# Altium project 2221_LocalisationSousMarine.PrjPcb
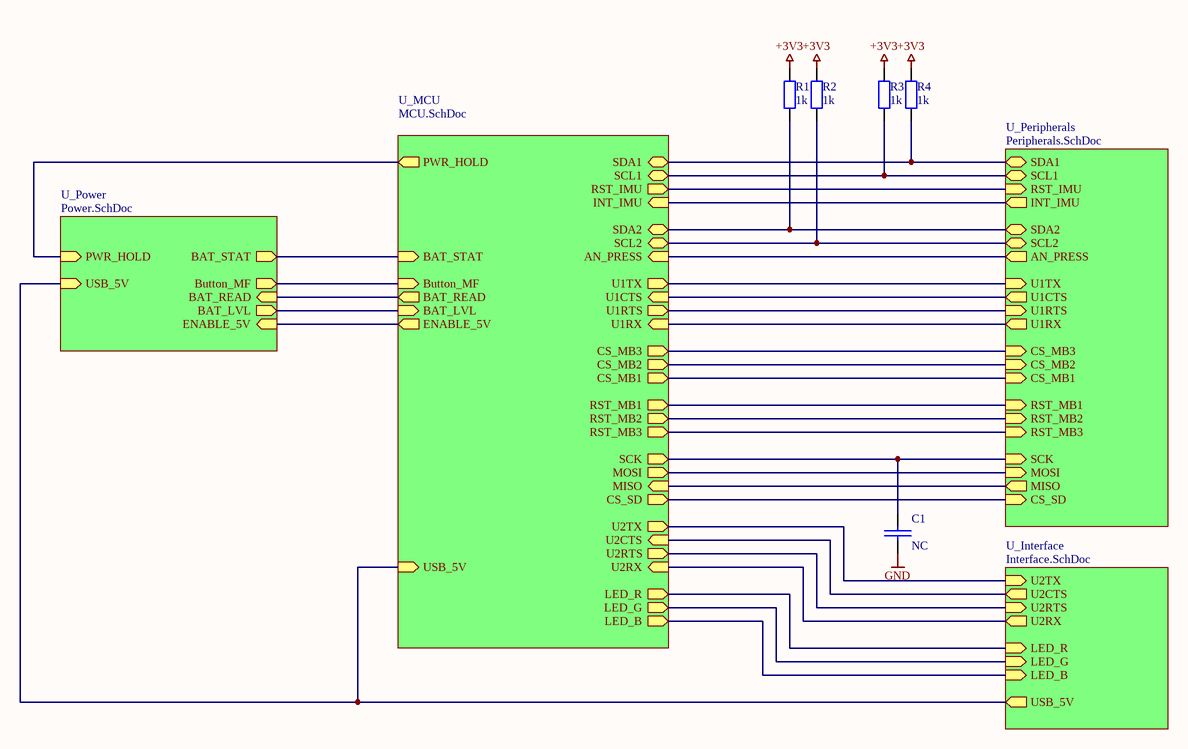
[diagram p0: SchemaBloc.SchDoc]
5 sheets, 150 parts. Net scope: hierarchical (ports join the sheet entries above them; power ports are global).
Board file: ES_Class6C_2L.PcbDoc
Sheets:
  SchemaBloc.SchDoc
    U_MCU = MCU.SchDoc
    U_Interface = Interface.SchDoc
    U_Power = Power.SchDoc
    U_Peripherals = Peripherals.SchDoc

## Sheet SchemaBloc.SchDoc
size A3; Date: 26.01.2022; Author: Ali Zoubir; CompanyName: ETML-ES; DrawnBy: Ali Zoubir; Engineer: Ali Zoubir; Organization: ETML-ES; Address1: Avenue Recordon 1; Address2: 1004 Lausanne; Address3: Switzerland; Revision: 2221; SheetNumber: 1; SheetTotal: 6; Version: V0

### Parts
C1  NC  [6-0805_L]
R1  1k  [6-0805_L]
R2  1k  [6-0805_L]
R3  1k  [6-0805_L]
R4  1k  [6-0805_L]

### Sub-sheets
U_Interface = Interface.SchDoc: USB_5V (out), LED_R (in), LED_G (in), LED_B (in), U2TX (in), U2CTS (out), U2RTS (in), U2RX (out)
U_MCU = MCU.SchDoc: SDA1 (bidir), SCL1 (bidir), CS_SD (out), BAT_STAT (in), RST_IMU (out), INT_IMU (in), PWR_HOLD (out), SDA2 (bidir), SCL2 (bidir), CS_MB1 (out), CS_MB2 (out), U1TX (out), U1CTS (in), U1RTS (out), U1RX (in), MISO (in), MOSI (out), SCK (out), Button_MF (in), CS_MB3 (out), BAT_LVL (in), BAT_READ (out), RST_MB1 (out), RST_MB2 (out), RST_MB3 (out), ENABLE_5V (out), USB_5V (in), LED_R (out), LED_G (out), LED_B (out), U2TX (out), U2CTS (in), U2RTS (out), U2RX (in), AN_PRESS (in)
U_Peripherals = Peripherals.SchDoc: SDA1 (bidir), SCL1 (bidir), RST_IMU (in), INT_IMU (out), CS_MB1 (in), CS_MB2 (in), U1TX (in), U1CTS (out), U1RTS (in), U1RX (out), CS_MB3 (in), SCL2 (bidir), SDA2 (bidir), SCK (in), MOSI (in), MISO (out), RST_MB1 (in), RST_MB2 (in), RST_MB3 (in), CS_SD (in), AN_PRESS (out)
U_Power = Power.SchDoc: BAT_STAT (out), PWR_HOLD (in), Button_MF (out), USB_5V (in), BAT_READ (in), BAT_LVL (out), ENABLE_5V (in)

### Nets
+3V3: R1.2 R2.2 R3.2 R4.2
GND: C1.2
VBUS: sheet U_MCU/USB_5V, sheet U_Interface/USB_5V, sheet U_Power/USB_5V
AnPress: sheet U_MCU/AN_PRESS, sheet U_Peripherals/AN_PRESS
BatLvl: sheet U_MCU/BAT_LVL, sheet U_Power/BAT_LVL
BatRead: sheet U_MCU/BAT_READ, sheet U_Power/BAT_READ
BatStat: sheet U_MCU/BAT_STAT, sheet U_Power/BAT_STAT
ButtonMF: sheet U_MCU/Button_MF, sheet U_Power/Button_MF
CS_SD: sheet U_MCU/CS_SD, sheet U_Peripherals/CS_SD
CSM1: sheet U_MCU/CS_MB1, sheet U_Peripherals/CS_MB1
CSM2: sheet U_MCU/CS_MB2, sheet U_Peripherals/CS_MB2
CSM3: sheet U_MCU/CS_MB3, sheet U_Peripherals/CS_MB3
EN_5V: sheet U_MCU/ENABLE_5V, sheet U_Power/ENABLE_5V
INT_IMU: sheet U_MCU/INT_IMU, sheet U_Peripherals/INT_IMU
LED_B: sheet U_MCU/LED_B, sheet U_Interface/LED_B
LED_G: sheet U_MCU/LED_G, sheet U_Interface/LED_G
LED_R: sheet U_MCU/LED_R, sheet U_Interface/LED_R
MISO: sheet U_MCU/MISO, sheet U_Peripherals/MISO
MOSI: sheet U_MCU/MOSI, sheet U_Peripherals/MOSI
PwrHold: sheet U_MCU/PWR_HOLD, sheet U_Power/PWR_HOLD
RA8: sheet U_MCU/U1CTS, sheet U_Peripherals/U1CTS
RB2: R2.1 ; sheet U_MCU/SCL2, sheet U_Peripherals/SCL2
RB3: R1.1 ; sheet U_MCU/SDA2, sheet U_Peripherals/SDA2
RB4: sheet U_MCU/U1TX, sheet U_Peripherals/U1TX
RB6: sheet U_MCU/RST_IMU, sheet U_Peripherals/RST_IMU
RB8: R3.1 ; sheet U_MCU/SCL1, sheet U_Peripherals/SCL1
RB9: R4.1 ; sheet U_MCU/SDA1, sheet U_Peripherals/SDA1
RB13: sheet U_MCU/U2CTS, sheet U_Interface/U2CTS
RB14: C1.1 ; sheet U_MCU/SCK, sheet U_Peripherals/SCK
RB15: sheet U_MCU/U2RTS, sheet U_Interface/U2RTS
RC2: sheet U_MCU/U2TX, sheet U_Interface/U2TX
RC3: sheet U_MCU/U1RX, sheet U_Peripherals/U1RX
RC4: sheet U_MCU/U1RTS, sheet U_Peripherals/U1RTS
RC8: sheet U_MCU/U2RX, sheet U_Interface/U2RX
RSTM1: sheet U_MCU/RST_MB1, sheet U_Peripherals/RST_MB1
RSTM2: sheet U_MCU/RST_MB2, sheet U_Peripherals/RST_MB2
RSTM3: sheet U_MCU/RST_MB3, sheet U_Peripherals/RST_MB3

### Notes on the sheet
- Fichier :
- a
- Date :
- Heure :
- Version :
- Auteur :
- Modif.
- b
- c
- d
- Projet :
- No :
- Nb feuilles
- Feuille n°
- Chemin :

### Library data of the parts
C1 = C: SDTSourceLibName: C:\WINDOWS\TEMP\DA.LIB; PCB Footprint: RC0805
R1-R4 = Res2: Res 0805; Published: 8-Jun-2000; LatestRevisionDate: 17-Jul-2002; LatestRevisionNote: Re-released for DXP Platform.; PackageReference: AXIAL-0.4; Publisher: Altium Limited; PackageDescription: Axial Device, Thru-Hole; 2 Leads; 0.4 in Pin Spacing; Value: 1k

## Sheet MCU.SchDoc
size A3; Author: Ali Zoubir; Organization: ETML-ES; Address1: Avenue Recordon 1; Address2: 1004 Lausanne; Address3: Switzerland; Revision: 2221; SheetNumber: 2; SheetTotal: 6; SPICEModelCacheGNAZWADN: <root> / <DocumentId>GNAZWADN</DocumentId> / </root>; Version: V0
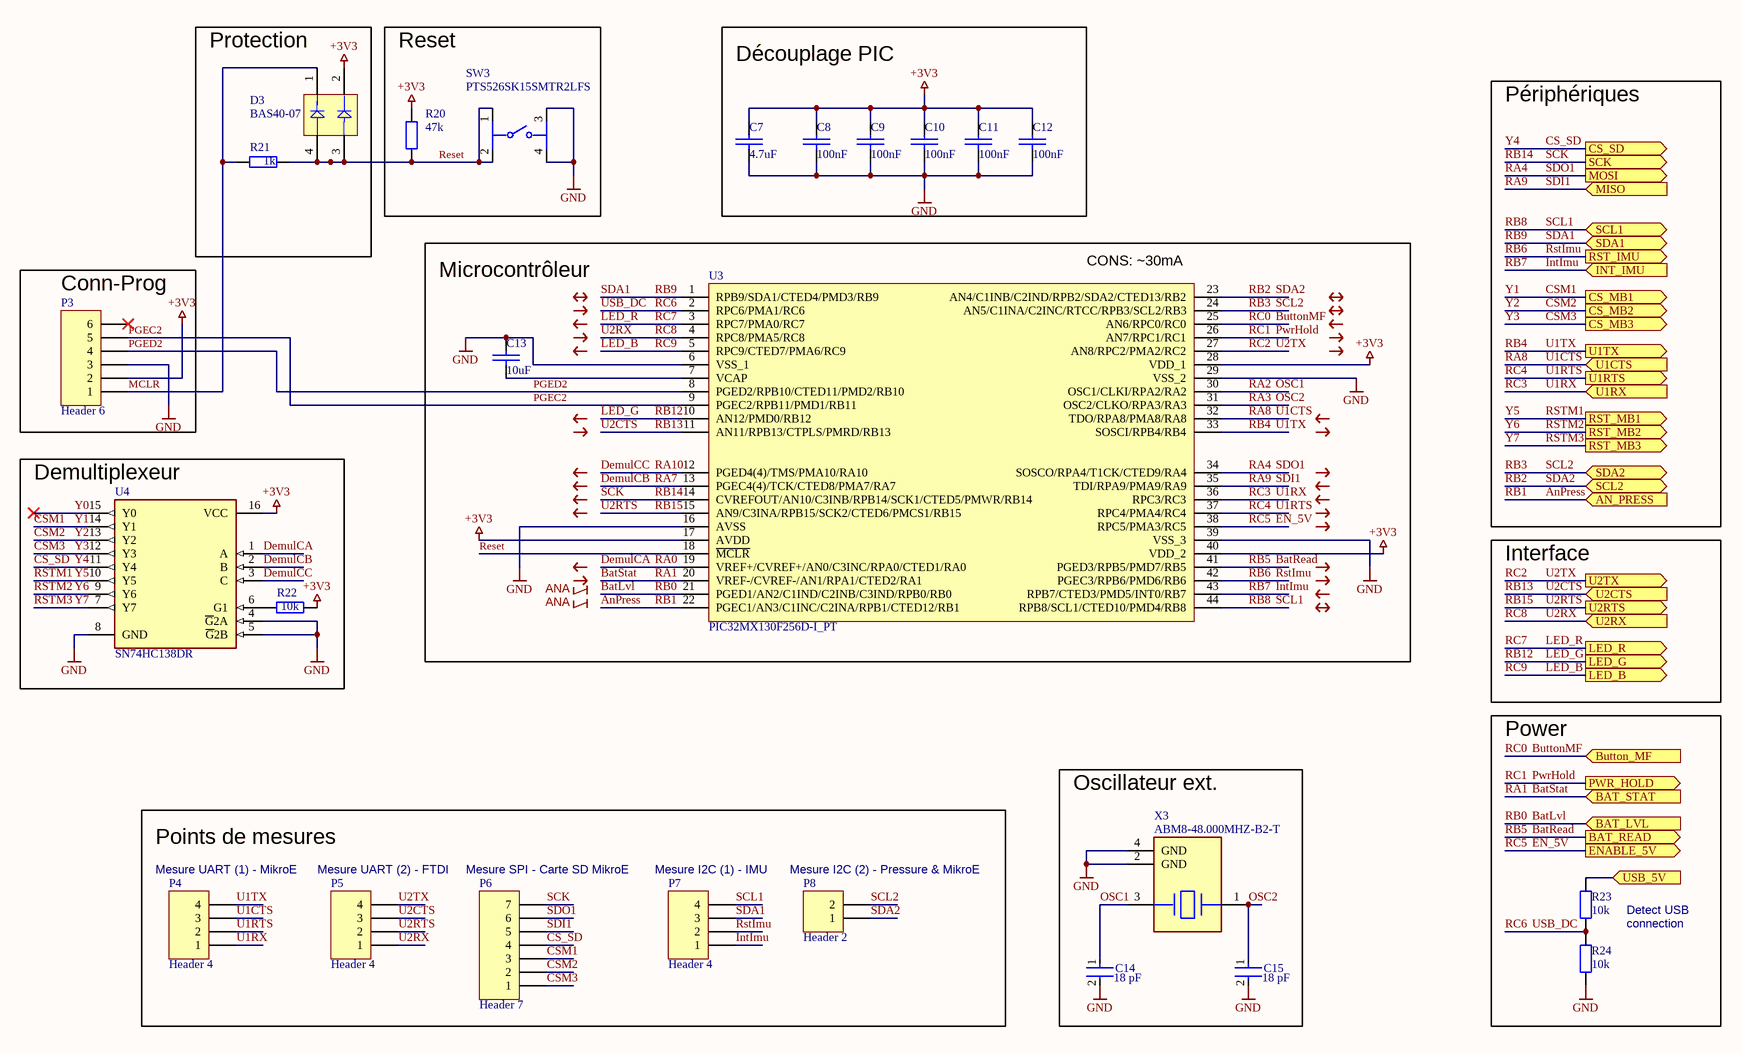
[diagram p1: MCU.SchDoc]

### Parts
C7  4.7uF  [6-0805_L]
C8  100nF  [6-0805_L]
C9  100nF  [6-0805_L]
C10  100nF  [6-0805_L]
C11  100nF  [6-0805_L]
C12  100nF  [6-0805_L]
C13  10uF  [6-0805_L]
C14  Capacitance: 18 pF  [FP-C0805C-DN-MFG]  (hidden comment: C0805C180J5GACTU)
C15  Capacitance: 18 pF  [FP-C0805C-DN-MFG]  (hidden comment: C0805C180J5GACTU)
D3  BAS40-07  [INF-SOT143_V]
P3  Header 6  [HDR1X6]
P4  Header 4  [HDR1X4]
P5  Header 4  [HDR1X4]
P6  Header 7  [HDR1X7]
P7  Header 4  [HDR1X4]
P8  Header 2  [HDR1X2]
R20  47k  [6-0805_L]
R21  1k  [6-0805_L]
R22  10k  [6-0805_L]
R23  10k  [6-0805_L]
R24  10k  [6-0805_L]
SW3  PTS526SK15SMTR2LFS  [FP-PTS526SK15SMTR2LFS-MFG]
U3  PIC32MX130F256D-I_PT  [QFP80P1200X1200X120-44N]
U4  SN74HC138DR  [FP-D0016A-IPC_A]
X3  ABM8-48.000MHZ-B2-T  [FP-ABM8-MFG]

### Blocks framed on the sheet
Protection: D3 R21
Reset: R20 SW3
Découplage PIC: C7-C12
Microcontrôleur: C13 U3
Conn-Prog: P3
Demultiplexeur: R22 U4
Power: R23 R24
Oscillateur ext.: C14 C15 X3
Points de mesures: P4-P8

### Ports
AN_PRESS (in), BAT_LVL (in), BAT_READ (out), BAT_STAT (in), Button_MF (in), CS_MB1 (out), CS_MB2 (out), CS_MB3 (out), CS_SD (out), ENABLE_5V (out), INT_IMU (in), LED_B (out), LED_G (out), LED_R (out), MISO (in), MOSI (out), PWR_HOLD (out), RST_IMU (out), RST_MB1 (out), RST_MB2 (out), RST_MB3 (out), SCK (out), SCL1 (bidir), SCL2 (bidir), SDA1 (bidir), SDA2 (bidir), U1CTS (in), U1RTS (out), U1RX (in), U1TX (out), U2CTS (in), U2RTS (out), U2RX (in), U2TX (out), USB_5V (in)

### Nets
+3V3: C7.1 C8.1 C9.1 C10.1 C11.1 C12.1 D3.2(K2) P3.2 R20.1 R22.2 U3.17(AVDD) U3.28(VDD_1) U3.40(VDD_2) U4.16(VCC)
GND: C7.2 C8.2 C9.2 C10.2 C11.2 C12.2 C13.1 C14.2 C15.2 P3.3 R24.1 SW3.3 SW3.4 U3.6(VSS_1) U3.16(AVSS) U3.29(VSS_2) U3.39(VSS_3) U4.4(~{G}2A) U4.5(~{G}2B) U4.8(GND) X3.2(GND) X3.4(GND)
VBUS: R23.2 ; port USB_5V
AnPress: U3.22(PGEC1/AN3/C1INC/C2INA/RPB1/CTED12/RB1) ; port AN_PRESS  [also labelled RB1]
BatLvl: U3.21(PGED1/AN2/C1IND/C2INB/C3IND/RPB0/RB0) ; port BAT_LVL  [also labelled RB0]
BatRead: U3.41(PGED3/RPB5/PMD7/RB5) ; port BAT_READ  [also labelled RB5]
BatStat: U3.20(VREF-/CVREF-/AN1/RPA1/CTED2/RA1) ; port BAT_STAT  [also labelled RA1]
ButtonMF: U3.25(AN6/RPC0/RC0) ; port Button_MF  [also labelled RC0]
CS_SD: P6.4 U4.11(Y4) ; port CS_SD  [also labelled Y4]
CSM1: P6.3 U4.14(Y1) ; port CS_MB1  [also labelled Y1]
CSM2: P6.2 U4.13(Y2) ; port CS_MB2  [also labelled Y2]
CSM3: P6.1 U4.12(Y3) ; port CS_MB3  [also labelled Y3]
DemulCA: U3.19(VREF+/CVREF+/AN0/C3INC/RPA0/CTED1/RA0) U4.1(A)  [also labelled RA0]
DemulCB: U3.13(PGEC4(4)/TCK/CTED8/PMA7/RA7) U4.2(B)  [also labelled RA7]
DemulCC: U3.12(PGED4(4)/TMS/PMA10/RA10) U4.3(C)  [also labelled RA10]
EN_5V: U3.38(RPC5/PMA3/RC5) ; port ENABLE_5V  [also labelled RC5]
IntImu: P7.1 U3.43(RPB7/CTED3/PMD5/INT0/RB7) ; port INT_IMU  [also labelled RB7]  [project net INT_IMU]
LED_B: U3.5(RPC9/CTED7/PMA6/RC9) ; port LED_B  [also labelled RC9]
LED_G: U3.10(AN12/PMD0/RB12) ; port LED_G  [also labelled RB12]
LED_R: U3.3(RPC7/PMA0/RC7) ; port LED_R  [also labelled RC7]
MCLR: D3.1(K1) P3.1 R21.1
OSC1: C14.1 U3.30(OSC1/CLKI/RPA2/RA2) X3.3  [also labelled RA2]
OSC2: C15.1 U3.31(OSC2/CLKO/RPA3/RA3) X3.1  [also labelled RA3]
PGEC2: P3.5 U3.9(PGEC2/RPB11/PMD1/RB11)
PGED2: P3.4 U3.8(PGED2/RPB10/CTED11/PMD2/RB10)
PwrHold: U3.26(AN7/RPC1/RC1) ; port PWR_HOLD  [also labelled RC1]
RA4: P6.6 U3.34(SOSCO/RPA4/T1CK/CTED9/RA4) ; port MOSI  [also labelled SDO1]  [project net MOSI]
RA8: P4.3 U3.32(TDO/RPA8/PMA8/RA8) ; port U1CTS  [also labelled U1CTS]
RA9: P6.5 U3.35(TDI/RPA9/PMA9/RA9) ; port MISO  [also labelled SDI1]  [project net MISO]
RB2: P8.1 U3.23(AN4/C1INB/C2IND/RPB2/SDA2/CTED13/RB2) ; port SCL2  [also labelled SDA2]
RB3: P8.2 U3.24(AN5/C1INA/C2INC/RTCC/RPB3/SCL2/RB3) ; port SDA2  [also labelled SCL2]
RB4: P4.4 U3.33(SOSCI/RPB4/RB4) ; port U1TX  [also labelled U1TX]
RB6: P7.2 U3.42(PGEC3/RPB6/PMD6/RB6) ; port RST_IMU  [also labelled RstImu]
RB8: P7.4 U3.44(RPB8/SCL1/CTED10/PMD4/RB8) ; port SCL1  [also labelled SCL1]
RB9: P7.3 U3.1(RPB9/SDA1/CTED4/PMD3/RB9) ; port SDA1  [also labelled SDA1]
RB13: P5.3 U3.11(AN11/RPB13/CTPLS/PMRD/RB13) ; port U2CTS  [also labelled U2CTS]
RB14: P6.7 U3.14(CVREFOUT/AN10/C3INB/RPB14/SCK1/CTED5/PMWR/RB14) ; port SCK  [also labelled SCK]
RB15: P5.2 U3.15(AN9/C3INA/RPB15/SCK2/CTED6/PMCS1/RB15) ; port U2RTS  [also labelled U2RTS]
RC2: P5.4 U3.27(AN8/RPC2/PMA2/RC2) ; port U2TX  [also labelled U2TX]
RC3: P4.1 U3.36(RPC3/RC3) ; port U1RX  [also labelled U1RX]
RC4: P4.2 U3.37(RPC4/PMA4/RC4) ; port U1RTS  [also labelled U1RTS]
RC6: R23.1 R24.2 U3.2(RPC6/PMA1/RC6)  [also labelled USB_DC]
RC8: P5.1 U3.4(RPC8/PMA5/RC8) ; port U2RX  [also labelled U2RX]
Reset: D3.3(A2) D3.4(A1) R20.2 R21.2 SW3.1 SW3.2 U3.18(~{MCLR})
RSTM1: U4.10(Y5) ; port RST_MB1  [also labelled Y5]
RSTM2: U4.9(Y6) ; port RST_MB2  [also labelled Y6]
RSTM3: U4.7(Y7) ; port RST_MB3  [also labelled Y7]
Y0: U4.15(Y0)
NetC13_2: C13.2 U3.7(VCAP)
NetR22_1: R22.1 U4.6(G1)

Not connected (* = marked no-connect by the designer): P3 6*

### Notes on the sheet
- Périphériques
- (near U3) CONS: ~30mA
- Interface
- ANA
- (near P4) Mesure UART (1) - MikroE
- (near P5) Mesure UART (2) - FTDI
- (near P6) Mesure SPI - Carte SD MikroE
- (near P7) Mesure I2C (1) - IMU
- (near P8) Mesure I2C (2) - Pressure & MikroE
- Detect USB
- connection
- Fichier :
- a
- Date :
- Heure :
- Version :
- Auteur :
- Modif.
- b
- c
- d
- Projet :
- No :
- Nb feuilles
- Feuille n°
- Chemin :

### Library data of the parts
C7-C13 = C: as C1 on sheet SchemaBloc
C14 C15 = CMP-2007-00302-2: CAP CER 18PF 50V C0G/NP0 0805; Manufacturer: KEMET; Temperature Characteristic: C0G; Tolerance: 0.05; Material: Ceramic; Temperature Coefficient: 30ppm/°C; Device Class L2: Capacitors; Temperature: -55°C to +125°C; Value: 18 pF; Package: C0805C-DN; Mouser Description: Cap Ceramic 18pF 50V C0G 5% SMD 0805 125C Paper T/R; Height: 0.88mm; ComponentLink2URL: https://content.kemet.com/datasheets/KEM_C1003_C0G_SMD.pdf; RoHS: TRUE; Octopart: https://octopart.com/c0805c180j5gactu-kemet-144810; ComponentLink2Description: Datasheet; Temperature Range High: +125°C; Digikey Description: CAP CER 18PF 50V C0G/NP0 0805; Device Class L1: Passive Components; Category: Cap; Automotive: No; Device Class L3: Ceramic Capacitors; Voltage Rating: 50 V; Temperature Range Low: -55°C; Ipc Land Pattern Name: CAPC200125X78; Lead Free: Yes; Manufacturer Part Number: C0805C180J5GACTU
D3 = CMP-1182-00009-1: Silicon Schottky Diode, -55 to 150 degC, SOT143, Reel, Green; Manufacturer: Infineon; VF (max): 1,000Â mV; CT (max): 5Â pF; VR (max): 40Â V; Green: TRUE; IF (max): 120Â mA; Configuration: Dual; ComponentLink1URL: http://www.infineon.com/; ComponentLink3URL: http://www.infineon.com/dgdl/SOT143-Package_Overview.pdf?folderId=db3a30431936bc4b011952ce8b1b3bed&fileId=db3a30431936bc4b011952df42203c0c; Packing: Reel; ComponentLink1Description: Manufacturer URL; Mounting Technology: Surface Mount; PartNumber: BAS40-07; ComponentLink2URL: http://www.infineon.com/dgdl/bas40_bas140series.pdf?folderId=db3a30431400ef68011425f1ca2505e3&fileId=db3a304314dca389011518a57ed20e11; PackageReference: SOT143; PackageDescription: 4-Pin Small Outline Transistor Package, 1.3 x 2.9 mm Body; ComponentLink2Description: Datasheet; ComponentLink3Description: Package Specification
P3 = Header 6: Header, 6-Pin; LatestRevisionDate: 17-Jul-2002; LatestRevisionNote: Re-released for DXP Platform.; Publisher: Altium Limited
P4 P5 P7 = Header 4: Header, 4-Pin; LatestRevisionDate: 17-Jul-2002; LatestRevisionNote: Re-released for DXP Platform.; Publisher: Altium Limited
P6 = Header 7: Header, 7-Pin; LatestRevisionDate: 17-Jul-2002; LatestRevisionNote: Re-released for DXP Platform.; Publisher: Altium Limited
P8 = Header 2: Header, 2-Pin; LatestRevisionDate: 17-Jul-2002; LatestRevisionNote: Re-released for DXP Platform.; Publisher: Altium Limited
R20 = Res2: Res 0805; Value: 1K; Published: 8-Jun-2000; LatestRevisionDate: 17-Jul-2002; LatestRevisionNote: Re-released for DXP Platform.; PackageReference: AXIAL-0.4; Publisher: Altium Limited; PackageDescription: Axial Device, Thru-Hole; 2 Leads; 0.4 in Pin Spacing
R21 R22 = Res2: Res 0805; Published: 8-Jun-2000; LatestRevisionDate: 17-Jul-2002; LatestRevisionNote: Re-released for DXP Platform.; PackageReference: AXIAL-0.4; Publisher: Altium Limited; PackageDescription: Axial Device, Thru-Hole; 2 Leads; 0.4 in Pin Spacing
  R21: Value: 1K
  R22: Value: 10k
R23 R24 = CMP-2001-04376-1: Res 0805; Manufacturer: Panasonic; Part Number: ERJ-6ENF1002V
SW3 = CMP-10040-000013-1: TACT 5.2 X 5.2, 1.5 MM H, 260GF,; Manufacturer: C&K; Operating Force: 250gf; Throw Configuration: SPST-NO; Contact Current Rating: 50mA; Standoff Height: 0mm; Contact Resistance: 100mΩ; Voltage Rating Dc: 12V; Electromechanical Life: 200000Cycles; Device Class L3: Tactile Switches; Device Class L2: Switches; Temperature: -20°C to +70°C; Temperature Range Low: -20°C; Package: PTS526SK15SMTR2LFS; Temperature Range High: +70°C; ComponentLink2Description: Datasheet; Device Class L1: Electromechanical; Height: 1.65mm; Digikey Description: TACT 5.2 X 5.2, 1.5 MM H, 260GF,; Category: Switch; RoHS: TRUE; Automotive: No; Lead Free: Yes; Manufacturer Part Number: PTS526SK15SMTR2LFS; Octopart: https://octopart.com/pts526+sk15+smtr2+lfs-c%26k+components-100617999; ComponentLink2URL: https://www.ckswitches.com/media/2780/pts526.pdf
U3 = PIC32MX130F256D-I_PT: Microchip PIC32MX130F256D-I/PT, 32bit PIC Microcontroller, 40MHz, 256 kB Flash, 44-Pin TQFP; Geometry.Height: 1.2mm; Mouser Part Number: 579-MX130F256DIPT; Mouser Price/Stock: https://www.mouser.co.uk/ProductDetail/Microchip-Technology/PIC32MX130F256D-I-PT?qs=XR%2FfMt4sL%252BEhDQElh0Q%2FjQ%3D%3D; Manufacturer_Name: Microchip; Manufacturer_Part_Number: PIC32MX130F256D-I/PT; Datasheet Link: https://componentsearchengine.com/Datasheets/5/PIC32MX130F256D-I_PT.pdf
U4 = CMP-1633-00238-3: IC 3-8 LINE DECOD/DEMUX 16-SOIC; Number of Elements: 1; Number of Output Lines: 8; Number of Inputs: 3; Logic Function: Demultiplexer; Polarity: Inverting; Max Frequency: 28MHz; Quiescent Current: 8uA; Propagation Delay: 225ns; High Level Output Current: -5.2mA; Supply Type: Single; Max Supply Voltage: 6V; Operating Supply Voltage: 5V; Low Level Output Current: 5.2mA; Max Power Dissipation: 320mW; Min Supply Voltage: 2V; Number of Pins: 16; RoHS Compliant: Yes; Number of Bits: 8; Length: 9.9mm; Case/Package: SOIC; Max Operating Temperature: 85°C; Number of Channels: 1; Radiation Hardening: No; Package Quantity: 2500; Number of Input Lines: 3; Max Supply Current: 8uA; REACH SVHC: No SVHC; Number of Outputs: 8; Independent Circuits: 1; Bandwidth: 28MHz; Number of Circuits: 1; Width: 3.91mm; Contact Plating: Gold; Packaging: Tape and Reel; Min Operating Temperature: -40°C; Lead Free: Lead Free; Height: 1.58mm; Weight: 0.004998oz; Mount: Surface Mount; Turn-On Delay Time: 225ns
X3 = CMP-27762-011708-1: Crystal 48MHz ±20ppm 18pF SMD-4 3.2mm x 2.5mm; Series Resistance: 35R; Frequency Stability: 50ppm; Package Quantity: 1000; Packaging: Tape and Reel; Mount: Surface Mount; Length: 3.2mm; Load Capacitance: 18pF; Max Operating Temperature: 70°C; Operating Frequency: 48 MHz; RoHS Compliant: Yes; Series: ABM8; Frequency Tolerance: 20ppm; Lead Free: Lead Free; Min Operating Temperature: -20°C; Case/Package: CSMD; Number of Pins: 4; Height: 0.031inch; ESR (Equivalent Series Resistance): 35R; Frequency: 48MHz; Radiation Hardening: No; Width: 0.098inch; Tolerance: 20ppm; Termination: SMD/SMT; Depth: 2.5mm; Resistor Type: Ceramic; REACH SVHC: No SVHC

## Sheet Interface.SchDoc
size A3; Author: Ali Zoubir; Organization: ETML-ES; Address1: Avenue Recordon 1; Address2: 1004 Lausanne; Address3: Switzerland; Revision: 2221; SheetNumber: 4; SheetTotal: 6; Version: V0
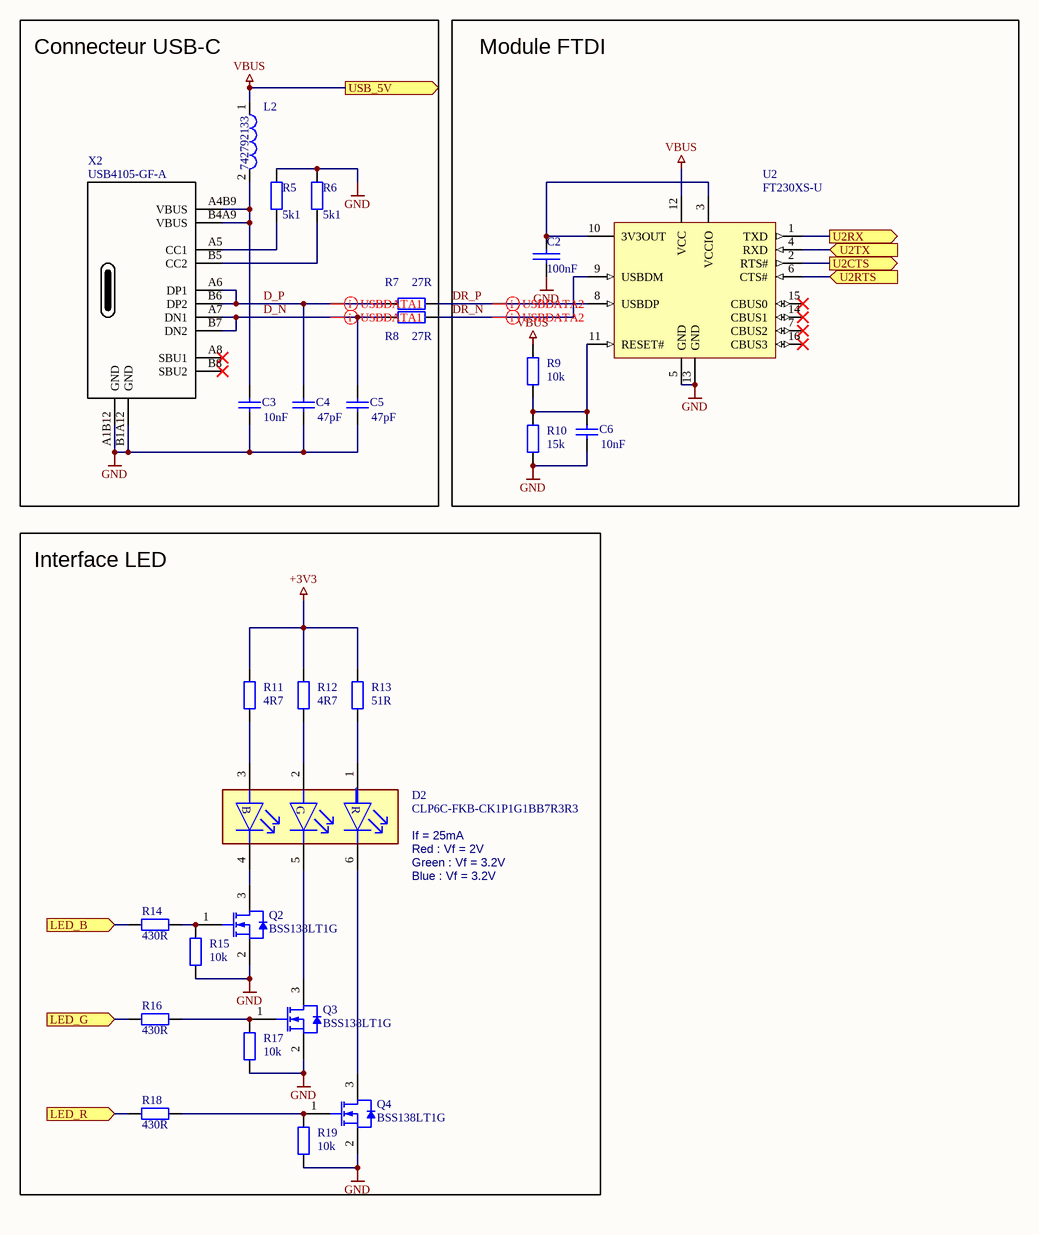
[diagram p2: Interface.SchDoc]

### Parts
C2  100nF  [6-0805_L]
C3  10nF  [6-0805_L]
C4  47pF  [6-0805_L]
C5  47pF  [6-0805_L]
C6  10nF  [6-0805_L]
D2  CLP6C-FKB-CK1P1G1BB7R3R3  [FP-CLP6C-FKB-CK1P1G1BB7R3-MFG]
L2  742792133  [SMD-1206]
Q2  BSS138LT1G  [ONSC-SOT-23-3-318-08_V]
Q3  BSS138LT1G  [ONSC-SOT-23-3-318-08_V]
Q4  BSS138LT1G  [ONSC-SOT-23-3-318-08_V]
R5  5k1  [6-0805_L]
R6  5k1  [6-0805_L]
R7  27R  [6-0805_L]
R8  27R  [6-0805_L]
R9  10k  [6-0805_L]
R10  15k  [6-0805_L]
R11  4R7  [6-0805_L]
R12  4R7  [6-0805_L]
R13  51R  [6-0805_L]
R14  430R  [6-0805_L]
R15  10k  [6-0805_L]
R16  430R  [6-0805_L]
R17  10k  [6-0805_L]
R18  430R  [6-0805_L]
R19  10k  [6-0805_L]
U2  FT230XS-U  [SSOP-16_N]
X2  USB4105-GF-A  [GCT_USB4105-GF-A]

### Blocks framed on the sheet
Connecteur USB-C: C3-C5 L2 R5-R8 X2
Module FTDI: C2 C6 R9 R10 U2
Interface LED: D2 Q2-Q4 R11-R19

### Ports
LED_B (in), LED_G (in), LED_R (in), U2CTS (out), U2RTS (in), U2RX (out), U2TX (in), USB_5V (out)

### Nets
+3V3: R11.2 R12.2 R13.2
GND: C2.2 C3.1 C4.1 C5.1 C6.1 Q2.2(S) Q3.2(S) Q4.2(S) R5.2 R6.2 R10.1 R15.1 R17.1 R19.1 U2.5(GND) U2.13(GND) X2.A1B12(GND) X2.B1A12(GND)
VBUS: L2.1 R9.2 U2.12(VCC) ; port USB_5V
D_N: C5.2 R8.1 X2.A7(DN1) X2.B7(DN2)
D_P: C4.2 R7.1 X2.A6(DP1) X2.B6(DP2)
DR_N: R8.2 U2.9(USBDM)
DR_P: R7.2 U2.8(USBDP)
LED_B: R14.2 ; port LED_B
LED_G: R16.2 ; port LED_G
LED_R: R18.2 ; port LED_R
RB13: U2.2(RTS#) ; port U2CTS
RB15: U2.6(CTS#) ; port U2RTS
RC2: U2.4(RXD) ; port U2TX
RC8: U2.1(TXD) ; port U2RX
NetC2_1: C2.1 U2.3(VCCIO) U2.10(3V3OUT)
NetC3_2: C3.2 L2.2 X2.A4B9(VBUS) X2.B4A9(VBUS)
NetC6_2: C6.2 R9.1 R10.2 U2.11(RESET#)
NetD2_1: D2.1(RED_A) R13.1
NetD2_2: D2.2(GREEN_A) R12.1
NetD2_3: D2.3(BLUE_A) R11.1
NetD2_4: D2.4(BLUE_C) Q2.3(D)
NetD2_5: D2.5(GREEN_C) Q3.3(D)
NetD2_6: D2.6(RED_C) Q4.3(D)
NetQ2_1: Q2.1(G) R14.1 R15.2
NetQ3_1: Q3.1(G) R16.1 R17.2
NetQ4_1: Q4.1(G) R18.1 R19.2
NetR5_1: R5.1 X2.A5(CC1)
NetR6_1: R6.1 X2.B5(CC2)

Not connected (* = marked no-connect by the designer): U2 7(CBUS2)* 14(CBUS1)* 15(CBUS0)* 16(CBUS3)*; X2 A8(SBU1)* B8(SBU2)*

### Layout directives
differential pair: D_N, D_P, DR_N, DR_P

### Notes on the sheet
- If = 25mA
- Red : Vf = 2V
- Green : Vf = 3.2V
- Blue : Vf = 3.2V
- Fichier :
- a
- Date :
- Heure :
- Version :
- Auteur :
- Modif.
- b
- c
- d
- Projet :
- No :
- Nb feuilles
- Feuille n°
- Chemin :
- (in symbol CMP-13977-000020-2) B; G; R

### Library data of the parts
C2 = C: as C1 on sheet SchemaBloc
C3-C6 = Cap: Capacitor; Published: 8-Jun-2000; LatestRevisionDate: 17-Jul-2002; LatestRevisionNote: Re-released for DXP Platform.; PackageReference: RAD-0.3; Publisher: Altium Limited; PackageDescription: Radial Cap, Thru-Hole; 2 Leads; 0.3 in Pin Spacing
  C3 C6: Value: 10nF
  C4 C5: Value: 47pF
D2 = CMP-13977-000020-2: LED RGB DIFFUSED 6PLCC SMD; Color: Blue; Luminous Intensity: 420mcd; Lens Style: Flat; Forward Voltage: 3.2V; Test Current: 20mA; Viewing Angle: 120°; Number of LEDs: 3; Dominant Wavelength: 470nm; Reverse Voltage: 5V; Lens Color: White; Lens Transparency: Diffused; Depth: 5mm; Case/Package: SMD/SMT; Number of Pins: 6; RoHS Compliant: Yes; Mount: Surface Mount; Packaging: Tape and Reel; Min Operating Temperature: -40°C; Height: 2.6mm; Package Quantity: 900; Width: 5mm; Forward Current: 20mA; Series: -; Number of Elements: 3; Length: 6mm; Max Operating Temperature: 100°C
L2 = CMP-0220-00010-1: SMD EMI Suppression Ferrite Bead WE-CBF, Z = 600 Ohm; Impedance: 600 Ohm; ComponentLink1Description: Manufacturer Link; DatasheetVersion: ver 2, Aug-2007; ComponentLink1URL: http://www.we-online.com; PackageDescription: Chip Inductor, 2-Leads, Body 3.2 x 1.6 mm; ComponentLink2URL: http://www.we-online.de/katalog/media/pdf/742792133.pdf; PackageVersion: 2007; PackageReference: SMD-1206; ComponentLink2Description: Datasheet
Q2-Q4 = CMP-1058-00767-1: Power MOSFET, 200 mA, 50 V, N-Channel, 3-Pin SOT-23, Pb-Free, Tape and Reel; Manufacturer: On Semiconductor; PD Max (W): 0.225; Coss Typ (pF): 12; V(BR)DSS Min (V): 50; VGS Max (V): 20; Channel Polarity: N Channel; Configuration: Single; VGS(th) Max (V): 1.5; Ciss Typ (pF): 40; Crss Typ (pF): 3.5; ID Max (A): 0.2; ComponentLink3Description: Package Specification; PackageDescription: 3-Pin Small Outline Transistor, Body 2.92 x 1.3 mm, Pitch 0.95 mm; PackageReference: SOT-23-3-318-08; RoHS: Pb-Free; Mounting Technology: Surface Mount; ComponentLink1Description: Manufacturer URL; ComponentLink2URL: http://www.onsemi.com/pub_link/Collateral/BSS138LT1-D.PDF; ComponentLink2Description: Datasheet; Packing: Tape and Reel; PackageVersion: Rev. AP, 11/2009; PartNumber: BSS138LT1G; Package Type: SOT-23-3; ComponentLink1URL: http://www.onsemi.com/; DatasheetVersion: Rev. 8; ComponentLink3URL: http://www.onsemi.cn/pub_link/Collateral/318-08.PDF
R5-R19 = Res2: Res 0805; Published: 8-Jun-2000; LatestRevisionDate: 17-Jul-2002; LatestRevisionNote: Re-released for DXP Platform.; PackageReference: AXIAL-0.4; Publisher: Altium Limited; PackageDescription: Axial Device, Thru-Hole; 2 Leads; 0.4 in Pin Spacing
  R5 R6: Value: 5k1
  R7 R8: Value: 27R
  R9 R15 R17 R19: Value: 10k
  R10: Value: 15k
  R11 R12: Value: 4R7
  R13: Value: 51R
  R14 R16 R18: Value: 430R
U2 = CMP-0248-00025-2: USB to Basic UART Interface Chip, UHCI/OHCI/EHCI Compatible, USB 2.0 Compatible, -40 to +85 degC, 16-Pin SSOP, Pb-Free, Tube; Manufacturer: FTDI; PackageDescription: 16-Pin Small Outline Package, 8.6 x 3.9 mm Body, 0.635 mm Pitch; ComponentLink2URL: http://www.ftdichip.com/Support/Documents/DataSheets/ICs/DS_FT230X.pdf; ComponentLink3URL: www.ftdichip.com/Products/ICs/FT230X.html; PartNumber: FT230XS-U; RevisionNote: DatasheetVersion updated to 1.2 Feb-2013; PackageVersion: Feb-13; ComponentLink2Description: Datasheet; Code_JEDEC: MO-137-AB; DatasheetVersion: ver 1.2, Feb-2013; ComponentLink1URL: http://www.ftdichip.com/; PackageReference: SSOP-16; ComponentLink1Description: Manufacturer URL; ComponentLink3Description: FT230X Product Page
X2 = USB-C Type 2.0: USB4105-GF-A USB connector; ComponentLink1Description: LCSC  C319148; ComponentLink1URL: https://lcsc.com/product-detail/USB-Connectors_XKB-Connectivity-U262-161N-4BVC11_C319148.html; Supplier 1: LCSC; Supplier Part Number 1: C319148

## Sheet Power.SchDoc
size A3; Author: Ali Zoubir; Organization: ETML-ES; Address1: Avenue Recordon 1; Address2: 1004 Lausanne; Address3: Switzerland; Revision: 2221; SheetNumber: 6; SheetTotal: 6; Version: V0
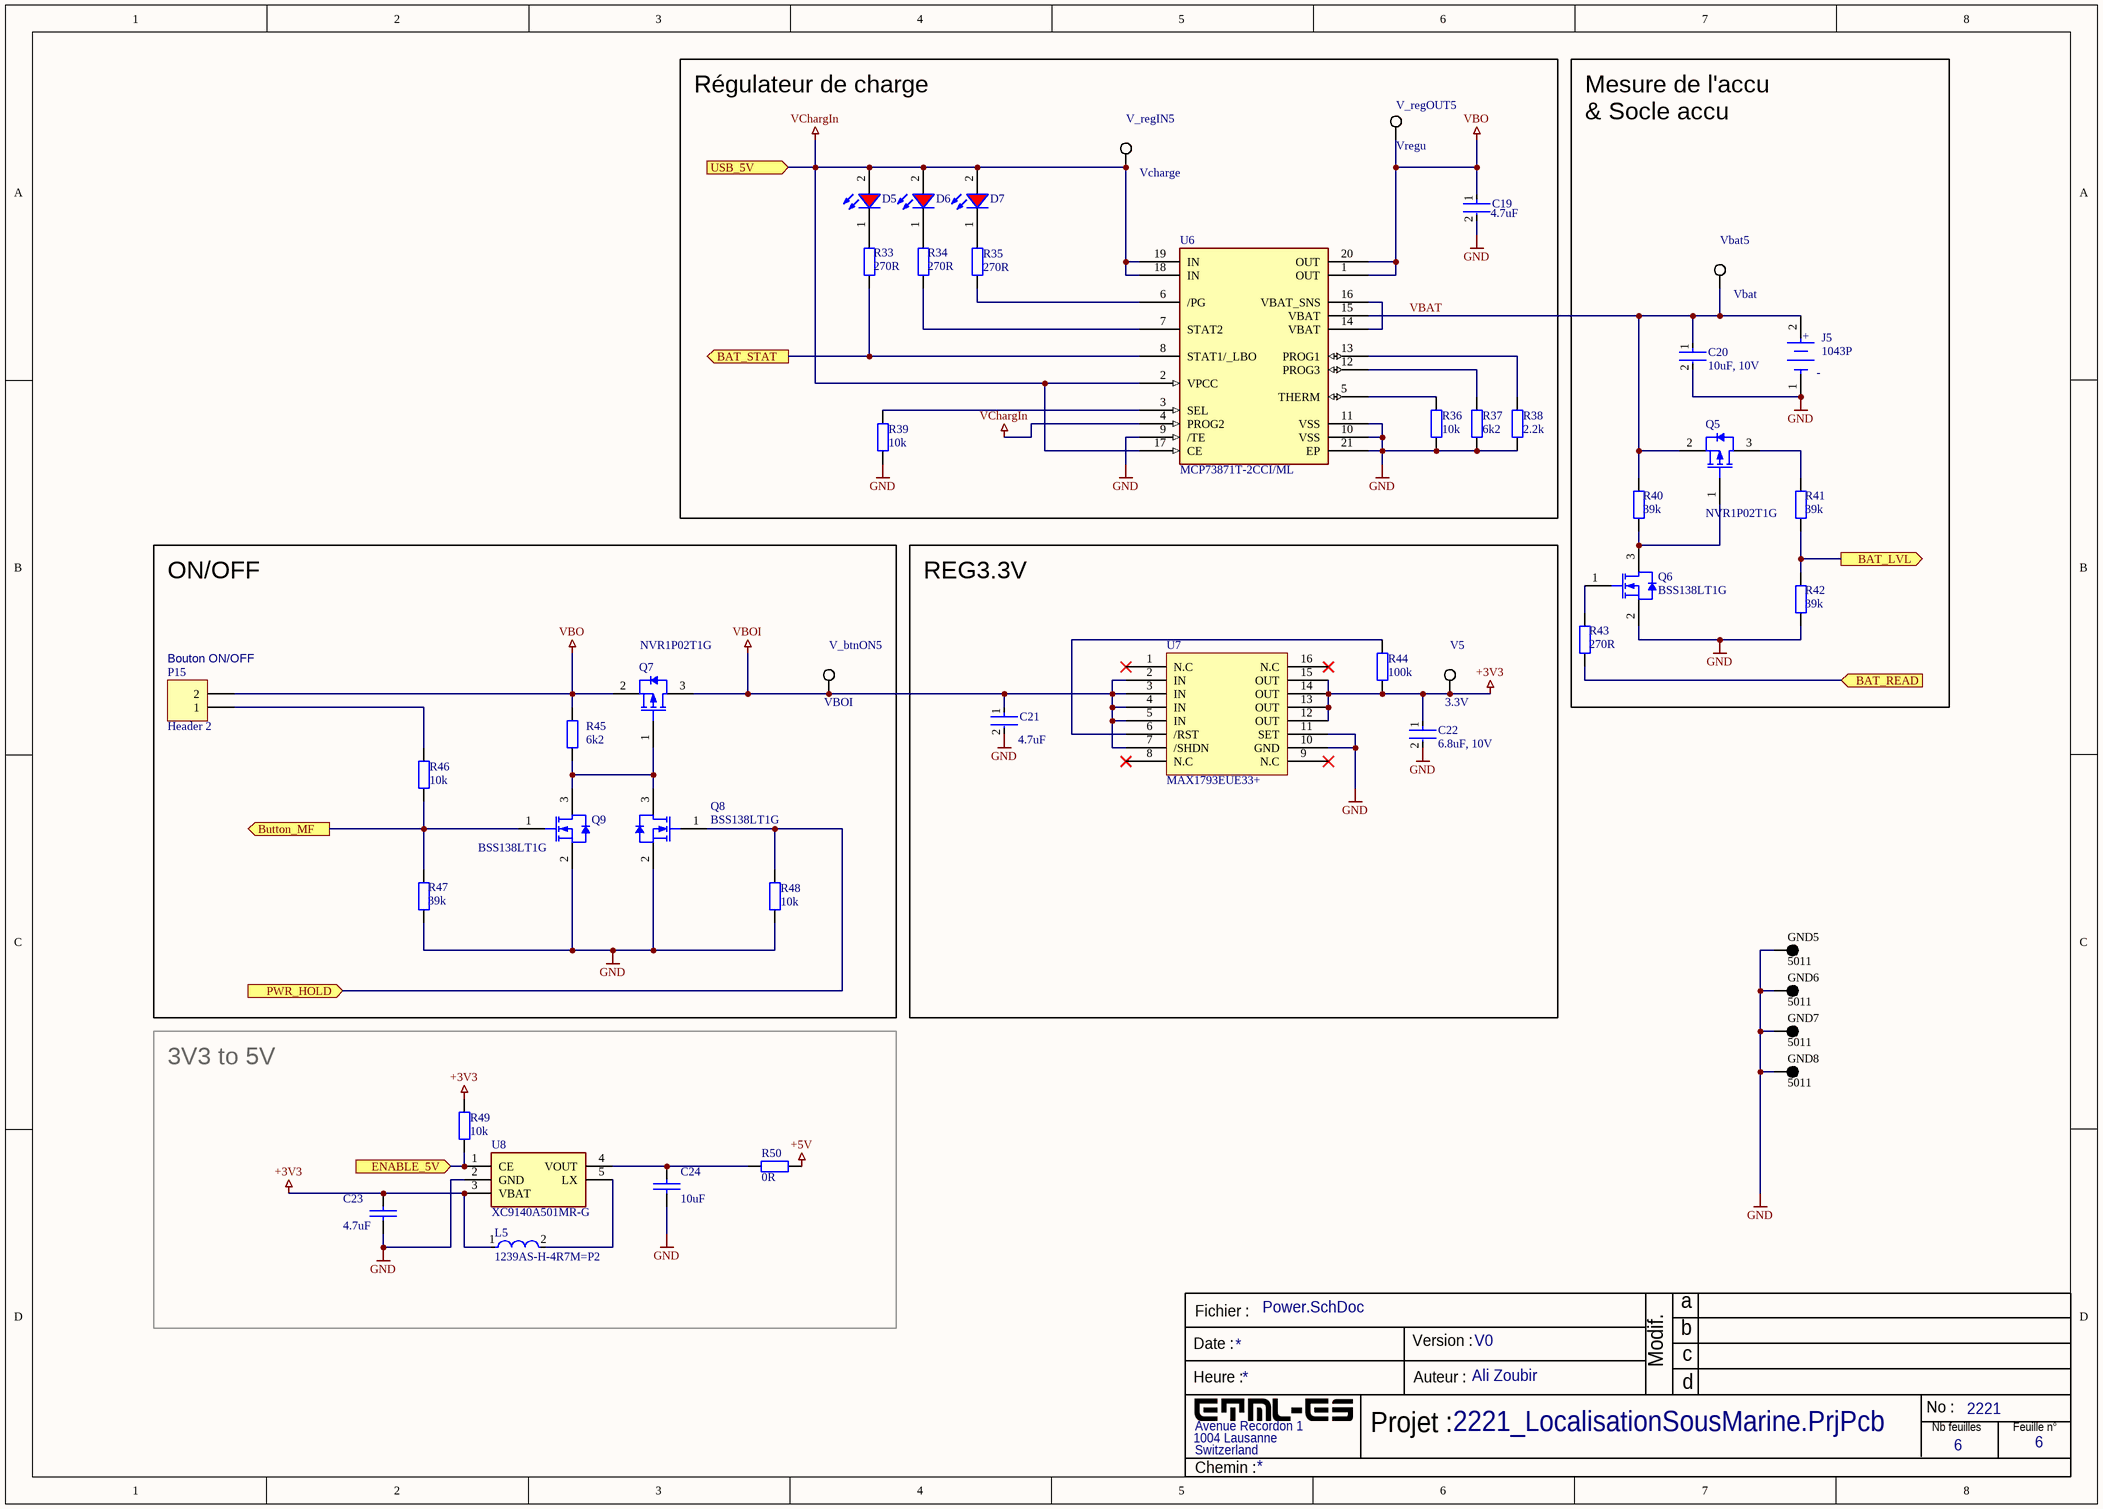
[diagram p3: Power.SchDoc]

### Parts
C19  Capacitance: 4.7uF  [6-0805_L]  (hidden comment: 4.7uF, 35V)
C20  10uF, 10V  [6-0805_L]
C21  Capacitance: 4.7uF  [6-0805_L]  (hidden comment: 4.7uF, 35V)
C22  6.8uF, 10V  [6-0805_L]
C23  4.7uF  [6-0805_L]
C24  10uF  [6-0805_L]
D5  Super Red, 1.9 V  [WL-SMCW_0805_150080xx75000]  (value not drawn)
D6  Super Red, 1.9 V  [WL-SMCW_0805_150080xx75000]  (value not drawn)
D7  Super Red, 1.9 V  [WL-SMCW_0805_150080xx75000]  (value not drawn)
GND5  5011  [KSTN-5011_V]
GND6  5011  [KSTN-5011_V]
GND7  5011  [KSTN-5011_V]
GND8  5011  [KSTN-5011_V]
J5  1043P  [FP-1043P-MFG]
L5  1239AS-H-4R7M=P2  [FP-DFE252012C-IPC_B]
P15  Header 2  [HDR1X2]
Q5  NVR1P02T1G  [ONSC-SOT-23-3-318-08_V]
Q6  BSS138LT1G  [ONSC-SOT-23-3-318-08_V]
Q7  NVR1P02T1G  [ONSC-SOT-23-3-318-08_V]
Q8  BSS138LT1G  [ONSC-SOT-23-3-318-08_V]
Q9  BSS138LT1G  [ONSC-SOT-23-3-318-08_V]
R33  270R  [6-0805_L]
R34  270R  [6-0805_L]
R35  270R  [6-0805_L]
R36  10k  [6-0805_L]
R37  6k2  [6-0805_L]
R38  2.2k  [6-0805_L]
R39  10k  [6-0805_L]
R40  39k  [6-0805_L]
R41  39k  [6-0805_L]
R42  39k  [6-0805_L]
R43  270R  [6-0805_L]
R44  100k  [6-0805_L]
R45  6k2  [6-0805_L]
R46  10k  [6-0805_L]
R47  39k  [6-0805_L]
R48  10k  [6-0805_L]
R49  10k  [6-0805_L]
R50  0R  [6-0805_L]
U6  MCP73871T-2CCI/ML  [Microchip_C04-126_IPC_B]
U7  MAX1793EUE33+  [TSOP65P640X110_HS-17N]
U8  XC9140A501MR-G  [SOT95P280X130-5N]
V5  3.3V  [KSTN-5019_V]
V_btnON5  VBOI  [KSTN-5019_V]
V_regIN5  Vcharge  [KSTN-5019_V]
V_regOUT5  Vregu  [KSTN-5019_V]
Vbat5  Vbat  [KSTN-5019_V]

### Blocks framed on the sheet
Régulateur de charge: C19 D5-D7 R33-R39 U6 V_regIN5 V_regOUT5
ON/OFF: P15 Q7-Q9 R45-R48 V_btnON5
REG3.3V: C21 C22 R44 U7 V5
3V3 to 5V: C23 C24 L5 R49 R50 U8

### Ports
BAT_LVL (out), BAT_READ (in), BAT_STAT (out), Button_MF (out), ENABLE_5V (in), PWR_HOLD (in), USB_5V (in)

### Nets
+3V3: C22.1 C23.1 L5.1 R44.1 R49.2 U7.12(OUT) U7.13(OUT) U7.14(OUT) U7.15(OUT) U8.3(VBAT) V5.1
+5V: R50.1
GND: C19.2 C20.2 C21.2 C22.2 C23.2 C24.2 GND5.1 GND6.1 GND7.1 GND8.1 J5.1(C) Q6.2(S) Q8.2(S) Q9.2(S) R36.1 R37.1 R38.1 R39.1 R42.1 R47.1 R48.1 U6.9(/TE) U6.10(VSS) U6.11(VSS) U6.21(EP) U7.10(GND) U7.11(SET) U8.2(GND)
VBO: C19.1 P15.2 Q7.2(S) R45.2 U6.1(OUT) U6.20(OUT) V_regOUT5.1
VBOI: C21.1 Q7.3(D) U7.2(IN) U7.3(IN) U7.4(IN) U7.5(IN) U7.7(/SHDN) V_btnON5.1
VChargIn: D5.2(A) D6.2(A) D7.2(A) U6.2(VPCC) U6.4(PROG2) U6.17(CE) U6.18(IN) U6.19(IN) V_regIN5.1 ; port USB_5V  [project net VBUS]
BatLvl: R41.1 R42.2 ; port BAT_LVL
BatRead: R43.1 ; port BAT_READ
BatStat: R33.1 U6.8(STAT1/_LBO) ; port BAT_STAT
ButtonMF: Q9.1(G) R46.1 R47.2 ; port Button_MF
EN_5V: R49.1 U8.1(CE) ; port ENABLE_5V
PwrHold: Q8.1(G) R48.2 ; port PWR_HOLD
VBAT: C20.1 J5.2(A) Q5.2(S) R40.2 U6.15(VBAT) Vbat5.1
NetC24_1: C24.1 R50.2 U8.4(VOUT)
NetD5_1: D5.1(K) R33.2
NetD6_1: D6.1(K) R34.2
NetD7_1: D7.1(K) R35.1
NetL5_2: L5.2 U8.5(LX)
NetP15_1: P15.1 R46.2
NetQ5_1: Q5.1(G) Q6.3(D) R40.1
NetQ5_3: Q5.3(D) R41.2
NetQ6_1: Q6.1(G) R43.2
NetQ7_1: Q7.1(G) Q8.3(D) Q9.3(D) R45.1
NetR34_1: R34.1 U6.7(STAT2)
NetR35_2: R35.2 U6.6(/PG)
NetR36_2: R36.2 U6.5(THERM)
NetR37_2: R37.2 U6.12(PROG3)
NetR38_2: R38.2 U6.13(PROG1)
NetR39_2: R39.2 U6.3(SEL)
NetR44_2: R44.2 U7.6(/RST)
NetU6_14: U6.14(VBAT) U6.16(VBAT_SNS)

Not connected (* = marked no-connect by the designer): U7 1(N.C)* 8(N.C)* 9(N.C)* 16(N.C)*

### Notes on the sheet
- Mesure de l'accu
- & Socle accu
- (near P15) Bouton ON/OFF
- Fichier :
- a
- Date :
- Heure :
- Version :
- Auteur :
- Modif.
- b
- c
- d
- Projet :
- No :
- Nb feuilles
- Feuille n°
- Chemin :
- (in symbol CMP-19636-000034-1) +

### Library data of the parts
C19 C21 = CMP-08246-002735-1: Multilayer Ceramic Capacitors 4.7μF ±10% 35V X7R SMD 0805; Tolerance: 10%; Depth: 1.25mm; RoHS Compliant: Yes; Construction: Flat; Radiation Hardening: No; Lead Free: Lead Free; Weight: 0.000194oz; Termination: SMD/SMT; Package Quantity: 2000; Dielectric: X7R; Mount: Surface Mount; Voltage Rating: 35V; Case/Package: 0805; Min Operating Temperature: -55°C; Dielectric Material: Ceramic; REACH SVHC: No SVHC; Series: C; Thickness: 0.057inch; Packaging: Tape and Reel; Case Code (Metric): 2012; Max Operating Temperature: 125°C; Case Code (Imperial): 0805; Height: 1.25mm; Width: 0.049inch; Length: 2mm; Voltage Rating (DC): 35V
C20 = CMP-2007-03243-2: CAP CER 10UF 10V X5R 0805; Manufacturer Part Number: C0805C106K8PACTU; Manufacturer: Kemet; 3DS Part Number: 220-00001; Tolerance: 10%; Temperature Coefficient: 15%; Material: Ceramic; Device Class L2: Capacitors; Device Class L1: Passive Components; ComponentLink2URL: https://content.kemet.com/datasheets/KEM_C1006_X5R_SMD.pdf; Height: 1.4mm; Lead Free: Yes; Digikey Description: CAP CER 10UF 10V X5R 0805; Octopart: https://octopart.com/c0805c106k8pactu-kemet-98697; Capacitance: 10uF; Value: 10uF; Temperature Range Low: -55°C; Temperature: -55°C to +85°C; Automotive: No; Mouser Description: CAP CER 10UF 10V X5R 0805; Ipc Land Pattern Name: CAPC200125X125; Temperature Range High: +85°C; Voltage: 10V; RoHS: TRUE; Device Class L3: Ceramic Capacitors; ComponentLink2Description: Datasheet; Voltage Rating: 10V; Package: C0805C-DG; Temperature Characteristic: X5R; Category: Cap
C22 = CMP-08246-000118-1: Cap Ceramic 6.8uF 10V X5R 20% Pad SMD 0805 +85°C Automotive T/R; Capacitance: 6.8uF; Packaging: Tape and Reel; Package Quantity: 2000; Width: 0.049inch; Voltage Rating (DC): 10V; Case Code (Imperial): 0805; Ratings: AEC-Q200; Min Operating Temperature: -55°C; Tolerance: 20%; Length: 0.079inch; Case/Package: 0805; Thickness: 0.057inch; Weight: 0.000194oz; Voltage Rating: 10V; Dielectric: X5R; Case Code (Metric): 2012; Height: 1.25mm; Max Operating Temperature: 85°C; Mount: Surface Mount
C23 C24 = C: as C1 on sheet SchemaBloc
D5-D7 = 150080SS75000: SMT Mono-color Chip LED Waterclear WL-SMCW, size 0805, Super Red, 1.9 V, 140 deg, 60 mcd; Forward Voltage: 1.9 V; Viewing Angle: 140 deg; Peak Wavelength: 645 nm; Dominant Wavelength: 630 nm; Luminous Intensity: 60 mcd; Chip Technology: AlInGaP; ComponentLink1Description: Manufacturer; ComponentLink1URL: http://www.we-online.de; ComponentLink2Description: Datasheet; ComponentLink2URL: https://katalog.we-online.de/led/datasheet/150080SS75000.pdf; Part Number: 150080SS75000; Published Date: November 2018; Publisher: Wurth Elektronik; Size: 0805; Operating Temperature: -40 to 85 degC; Emitting Color: Super Red; Mounting Technology: SMT; Packaging: Tape and Reel; Supplier 1: Digi-Key; Supplier Part Number 1: 732-4985-1-ND; Supplier 2: Distrelec; Supplier Part Number 2: 30008875
GND5-GND8 = CMP-1672-00003-4: Test Point, Black, Through Hole, RoHS, Bulk; Manufacturer: Keystone; ComponentLink2URL: http://www.keyelco.com/product-pdf.cfm?p=1320; Colour: Black; Pins: 1; REACH SVHC: No SVHC; ComponentLink1URL: http://www.keyelco.com/; PackageReference: 5011; Contact Plating: Silver; Package Quantity: 100; Packaging: Bulk; RoHSCompliant: true; Height: 8.12 mm; PackageDescription: 1-Pin Through Hole Device, Dia 3.17 mm; Mount: Through Hole; Mounting Technology: Through Hole; DatasheetVersion: Rev. F, 12/2013; ComponentLink1Description: Manufacturer URL; Contact Material: Bronze; ComponentLink2Description: Datasheet
J5 = CMP-19636-000034-1: BATT HOLDER 18650 1 CELL PC PIN; Number of Cells: 1; Series: -; Termination: PC Pin; Package Quantity: 50; Min Operating Temperature: -50°C; Mount: Through Hole; Packaging: Tray; Max Operating Temperature: 145°C
L5 = CMP-06042-003985-1: Shielded Wirewound Inductor 4.7uH 20% 1300mA 0.24Ω 1008 (2520); Current Rating: 1.5A; Core Material: Ferrite; DC Resistance (DCR): 240mR; Test Frequency: 1MHz; Resistor Type: Wirewound; Mount: Surface Mount; Case/Package: 1008; Case Code (Metric): 2520; Inductance: 4.7uH; Width: 0.079inch; Min Operating Temperature: -40°C; Height - Seated (Max): 0.047inch; Length: 0.098inch; Max Operating Temperature: 85°C; Tolerance: 20%; Case Code (Imperial): 1008; Shielding: Shielded; Packaging: Tape and Reel
P15 = Header 2: Header, 2-Pin; LatestRevisionDate: 17-Jul-2002; LatestRevisionNote: Re-released for DXP Platform.; Publisher: Altium Limited
Q5 Q7 = CMP-1058-00745-1: Power MOSFET, -20 V, -1 A, P-Channel, 3-Pin SOT-23, Pb-Free, Tape and Reel; Manufacturer: On Semiconductor; Ciss Typ (pF): 165; Configuration: Single; VGS(th) Max (V): 2.3; Channel Polarity: P Channel; V(BR)DSS Min (V): 20; ID Max (A): 1; Coss Typ (pF): 110; Qrr Typ (nC): 8; Crss Typ (pF): 35; PD Max (W): 0.4; DatasheetVersion: Rev. 7; ComponentLink1Description: Manufacturer URL; PackageReference: SOT-23-3-318-08; ComponentLink2Description: Datasheet; ComponentLink2URL: http://www.onsemi.cn/pub_link/Collateral/NTR1P02T1-D.PDF; Packing: Tape and Reel; Package Type: SOT-23-3; ComponentLink1URL: http://www.onsemi.com/; RoHS: Pb-Free; PartNumber: NVR1P02T1G; PackageVersion: Rev. AP, 11/2009; PackageDescription: 3-Pin Small Outline Transistor, Body 2.92 x 1.3 mm, Pitch 0.95 mm; ComponentLink3URL: http://www.onsemi.cn/pub_link/Collateral/318-08.PDF; ComponentLink3Description: Package Specification; VGS Max (V): 20; Mounting Technology: Surface Mount
Q6 Q8 Q9 = CMP-1058-00767-1: as Q2 on sheet Interface; ComponentLink3Description: Package Specification; PackageDescription: 3-Pin Small Outline Transistor, Body 2.92 x 1.3 mm, Pitch 0.95 mm; PackageReference: SOT-23-3-318-08; RoHS: Pb-Free; Mounting Technology: Surface Mount; ComponentLink1Description: Manufacturer URL; ComponentLink2URL: http://www.onsemi.com/pub_link/Collateral/BSS138LT1-D.PDF; ComponentLink2Description: Datasheet; Packing: Tape and Reel; PackageVersion: Rev. AP, 11/2009; PartNumber: BSS138LT1G; Package Type: SOT-23-3; ComponentLink1URL: http://www.onsemi.com/; DatasheetVersion: Rev. 8; ComponentLink3URL: http://www.onsemi.cn/pub_link/Collateral/318-08.PDF
R33-R35 R43 = CMP-2001-00528-1: Res 0805; Part Number: ERJ6ENF2703V; Manufacturer: Panasonic
R36 R39 R46 R48 R49 = CMP-2001-04376-1: as R23 on sheet MCU
R37 = CMP-2001-04031-1: Res 0805; Manufacturer: Vishay Dale; Part Number: CRCW08055K60JNEA
R38 = CMP-1013-00510-2: Res 0805; Part Number: CRCW08051K00FKEA; Manufacturer: Vishay Dale
R40-R42 R47 = CMP-2001-00410-1: Res 0805; Part Number: ERJ-6GEYJ393V; Manufacturer: Panasonic
R44 = CMP-2001-00479-1: Res 0805; Manufacturer: Panasonic; Part Number: ERJ-P06J104V
R45 = CMP-2001-00562-1: Res 0805; Part Number: ERJ6ENF6201V; Manufacturer: Panasonic
R50 = Res2: Res 0805; Published: 8-Jun-2000; LatestRevisionDate: 17-Jul-2002; LatestRevisionNote: Re-released for DXP Platform.; PackageReference: AXIAL-0.4; Publisher: Altium Limited; PackageDescription: Axial Device, Thru-Hole; 2 Leads; 0.4 in Pin Spacing; Value: 0R
U6 = MCP73871T-2CCI/ML: Charger IC Lithium Ion/Polymer 20-QFN _4x4_; MF: Microchip; SnapEDA_Link: https://www.snapeda.com/parts/MCP73871T-2CCI/ML/Microchip/view-part/1049920/?ref=snap; Value: *; Digi-Key_Part_Number: MCP73871T-2CCI/MLCT-ND; MP: MCP73871T-2CCI/ML; Digi-Key_Purchase_URL: https://www.digikey.com/product-detail/en/microchip-technology/MCP73871T-2CCI-ML/MCP73871T-2CCI-MLCT-ND/7065594?utm_source=snapeda&utm_medium=aggregator&utm_campaign=symbol; Package: QFN-20 Microchip
U8 = XC9140A501MR-G: Switching Voltage Regulators PFM Control Snchrns StepUpDCDC Converter; Manufacturer_Name: Torex; Geometry.Height: 1.3mm; Mouser Part Number: 865-XC9140A501MR-G; Mouser Price/Stock: https://www.mouser.co.uk/ProductDetail/Torex-Semiconductor/XC9140A501MR-G?qs=AsjdqWjXhJ8xw9tvUM0FMA%3D%3D; Manufacturer_Part_Number: XC9140A501MR-G; Datasheet Link: *
V5 V_btnON5 V_regIN5 V_regOUT5 Vbat5 = CMP-1672-00008-1: Test Point, 1 Position SMD, RoHS, Tape and Reel; ComponentLink1Description: Manufacturer URL; Package Quantity: 1000; DatasheetVersion: 03/2014; Packaging: Tape and Reel; ComponentLink2URL: http://www.keyelco.com/product-pdf.cfm?p=1357; ComponentLink1URL: http://www.keyelco.com/; Mount: Surface Mount; Contact Plating: Silver; PackageDescription: 1-Pin Surface Mount Device, Body 3.81 x 2.03 mm; Pins: 1; RoHSCompliant: True; Mounting Technology: Surface Mount; ComponentLink2Description: Datasheet; PackageReference: 5019

## Sheet Peripherals.SchDoc
size A3; Author: Ali Zoubir; Organization: ETML-ES; Address1: Avenue Recordon 1; Address2: 1004 Lausanne; Address3: Switzerland; Revision: 2221; SheetNumber: 5; SheetTotal: 6; Version: V0
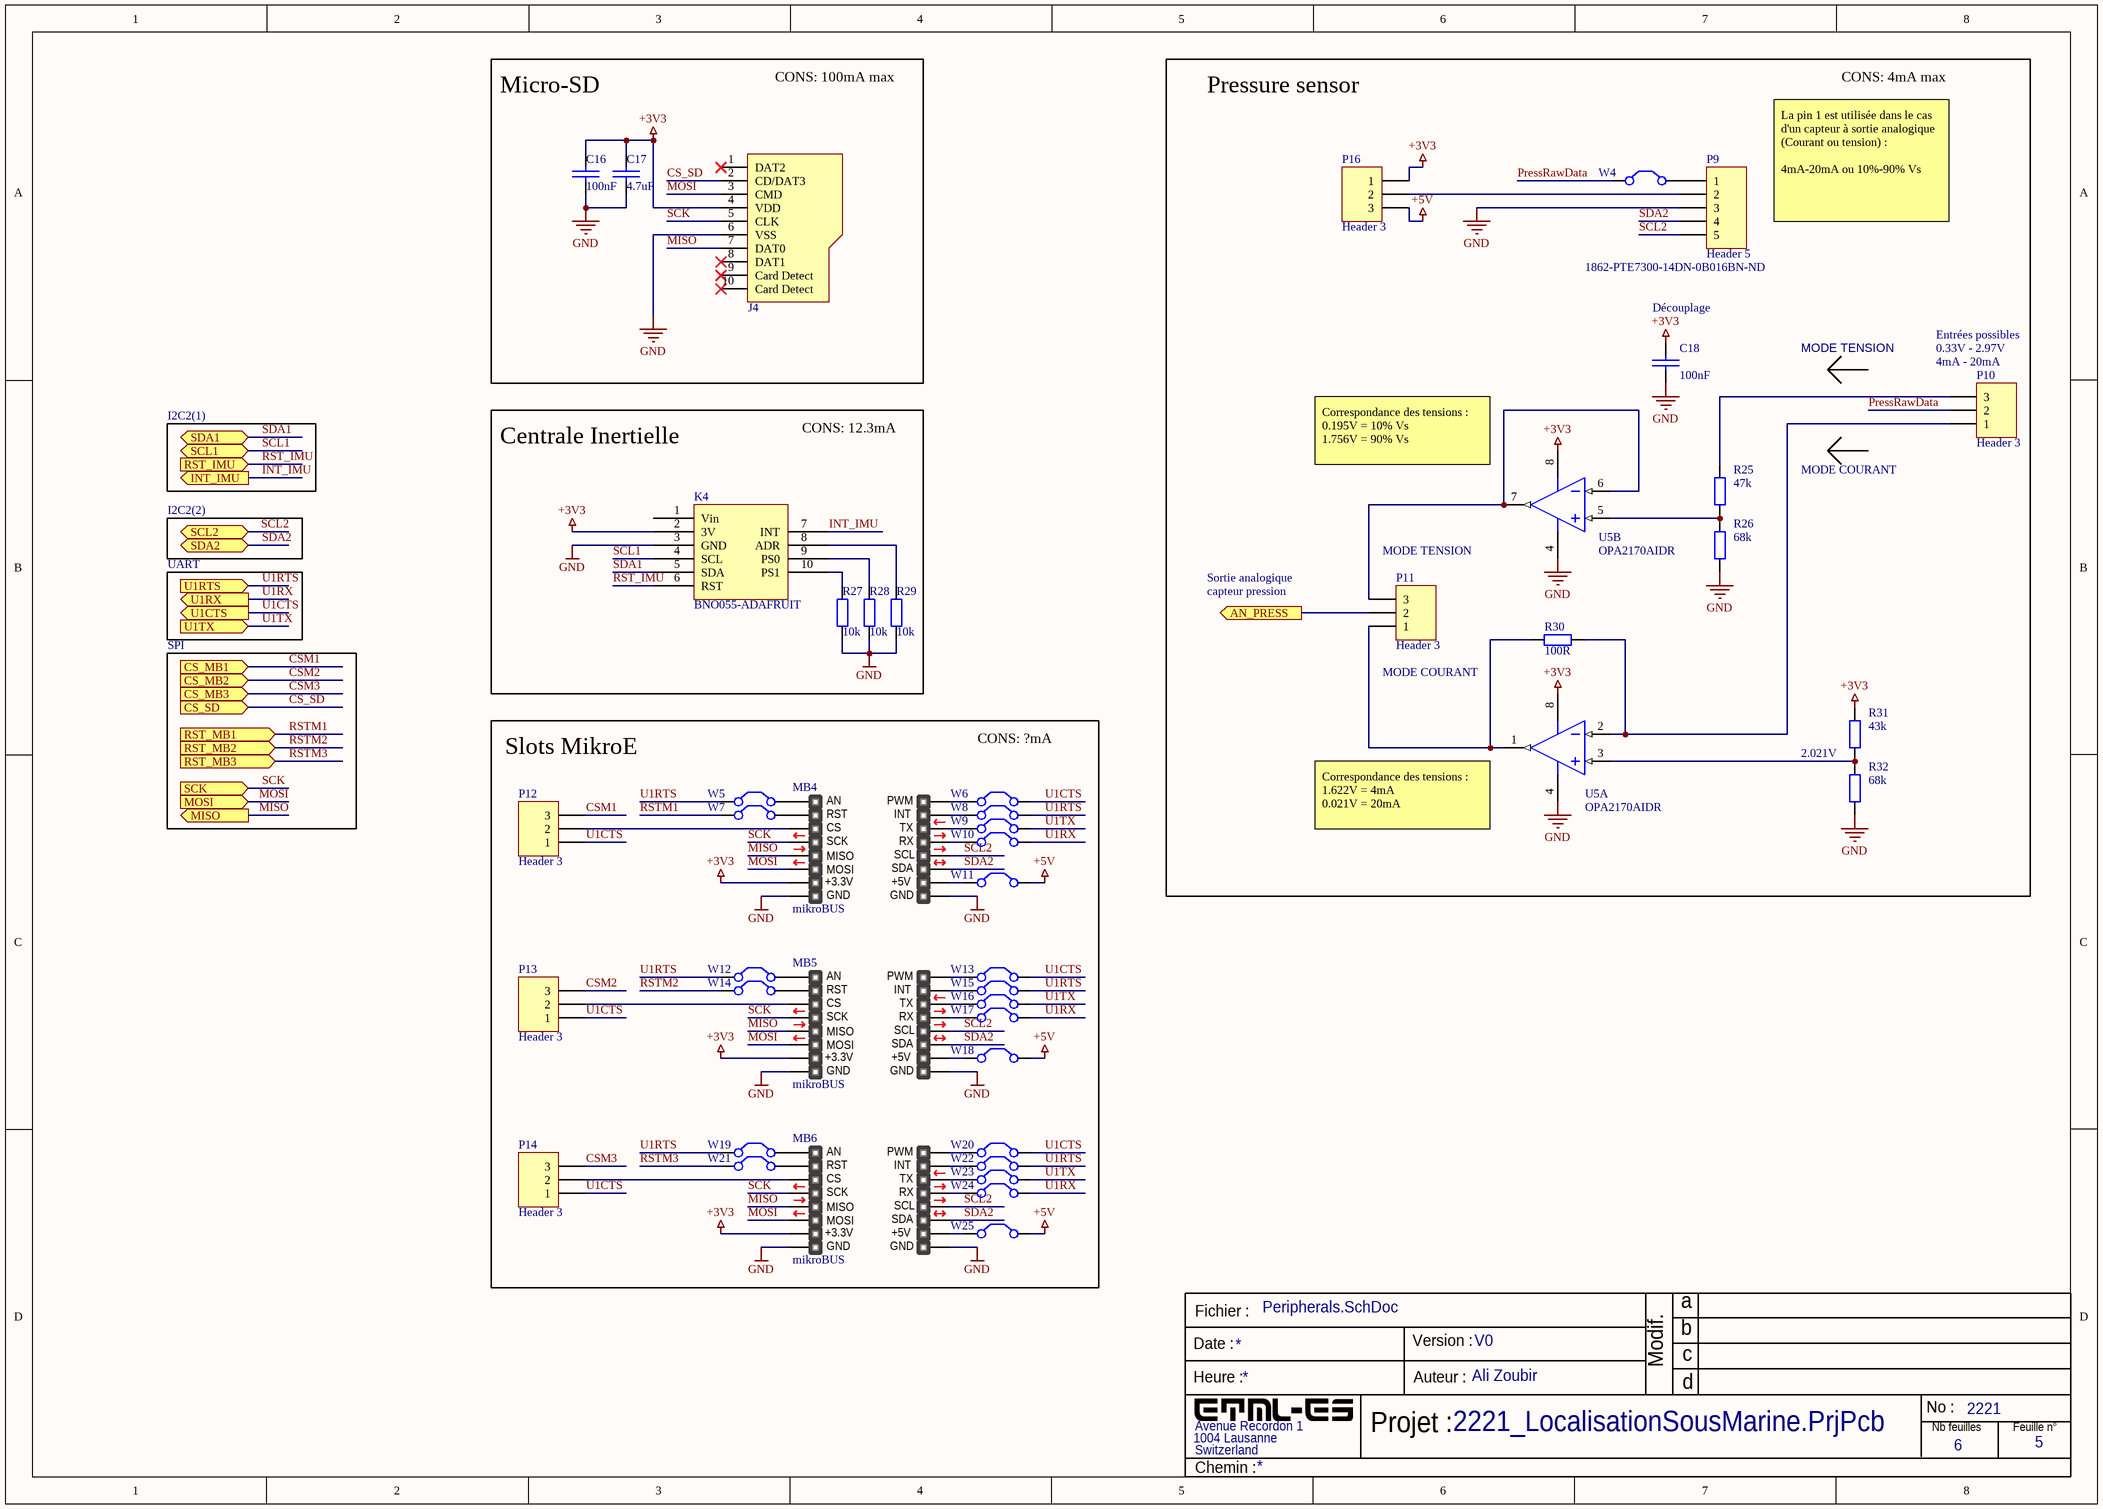
[diagram p4: Peripherals.SchDoc]

### Parts
C16  100nF  [6-0805_L]
C17  4.7uF  [6-0805_L]
C18  100nF  [6-0805_L]
J4  693071010811  [uSD-WE-693071010811]  (value not drawn)
K4  BNO055-ADAFRUIT  [BNO055-ADAFRUIT]
MB4  mikroBUS  [mikroBUS - Large]  (no BOM)
MB5  mikroBUS  [mikroBUS - Large]  (no BOM)
MB6  mikroBUS  [mikroBUS - Large]  (no BOM)
P9  Header 5  Supplier Part Number 1: 1862-PTE7300-14DN-0B016BN-ND  [HDR1X5]
P10  Header 3  [HDR1X3]
P11  Header 3  [HDR1X3]
P12  Header 3  [HDR1X3]
P13  Header 3  [HDR1X3]
P14  Header 3  [HDR1X3]
P16  Header 3  [HDR1X3]
R25  47k  [6-0805_L]
R26  68k  [6-0805_L]
R27  10k  [6-0805_L]
R28  10k  [6-0805_L]
R29  10k  [6-0805_L]
R30  100R  [6-0805_L]
R31  43k  [6-0805_L]
R32  68k  [6-0805_L]
U5  OPA2170AIDR  [D0008A_M]  (parts A,B of 2)
W4  Jumper  [JUMPER]  (value not drawn)
W5  Jumper  [JUMPER]  (value not drawn)
W6  Jumper  [JUMPER]  (value not drawn)
W7  Jumper  [JUMPER]  (value not drawn)
W8  Jumper  [JUMPER]  (value not drawn)
W9  Jumper  [JUMPER]  (value not drawn)
W10  Jumper  [JUMPER]  (value not drawn)
W11  Jumper  [JUMPER]  (value not drawn)
W12  Jumper  [JUMPER]  (value not drawn)
W13  Jumper  [JUMPER]  (value not drawn)
W14  Jumper  [JUMPER]  (value not drawn)
W15  Jumper  [JUMPER]  (value not drawn)
W16  Jumper  [JUMPER]  (value not drawn)
W17  Jumper  [JUMPER]  (value not drawn)
W18  Jumper  [JUMPER]  (value not drawn)
W19  Jumper  [JUMPER]  (value not drawn)
W20  Jumper  [JUMPER]  (value not drawn)
W21  Jumper  [JUMPER]  (value not drawn)
W22  Jumper  [JUMPER]  (value not drawn)
W23  Jumper  [JUMPER]  (value not drawn)
W24  Jumper  [JUMPER]  (value not drawn)
W25  Jumper  [JUMPER]  (value not drawn)

### Blocks framed on the sheet
Micro-SD: C16 C17 J4
Pressure sensor: C18 P9-P11 P16 R25 R26 R30-R32 U5 W4
Centrale Inertielle: K4 R27-R29
Slots MikroE: MB4-MB6 P12-P14 W5-W25

### Ports
AN_PRESS (out), CS_MB1 (in), CS_MB2 (in), CS_MB3 (in), CS_SD (in), INT_IMU (out), MISO (out), MOSI (in), RST_IMU (in), RST_MB1 (in), RST_MB2 (in), RST_MB3 (in), SCK (in), SCL1 (bidir), SCL2 (bidir), SDA1 (bidir), SDA2 (bidir), U1CTS (out), U1RTS (in), U1RX (out), U1TX (in)

### Nets
+3V3: C16.1 C17.1 C18.1 J4.4(VDD) K4.2(3V) MB4.7(3.3V) MB5.7(3.3V) MB6.7(3.3V) P16.1 R31.2 U5.8(V+)
+5V: P16.3 W11.2(C2) W18.2(C2) W25.2(C2)
GND: C16.2 C17.2 C18.2 J4.6(VSS) K4.3(GND) MB4.8(GND) MB4.9(GND) MB5.8(GND) MB5.9(GND) MB6.8(GND) MB6.9(GND) P9.3 R26.1 R27.1 R28.1 R29.1 R32.1 U5.4(V-)
AnPress: P11.2 ; port AN_PRESS
CS_SD: J4.2(CD/DAT3) ; port CS_SD
CSM1: P12.3 ; port CS_MB1
CSM2: P13.3 ; port CS_MB2
CSM3: P14.3 ; port CS_MB3
INT_IMU: K4.7(INT) ; port INT_IMU
MISO: J4.7(DAT0) MB4.5(MISO) MB5.5(MISO) MB6.5(MISO) ; port MISO
MOSI: J4.3(CMD) MB4.6(MOSI) MB5.6(MOSI) MB6.6(MOSI) ; port MOSI
PressRawData: P10.2 W4.1(C1)
RST_IMU: K4.6(RST) ; port RST_IMU  [project net RB6]
RSTM1: W7.1(C1) ; port RST_MB1
RSTM2: W14.1(C1) ; port RST_MB2
RSTM3: W21.1(C1) ; port RST_MB3
SCK: J4.5(CLK) MB4.4(SCK) MB5.4(SCK) MB6.4(SCK) ; port SCK  [project net RB14]
SCL1: K4.4(SCL) ; port SCL1  [project net RB8]
SCL2: MB4.12(SCL) MB5.12(SCL) MB6.12(SCL) P9.5 ; port SCL2  [project net RB2]
SDA1: K4.5(SDA) ; port SDA1  [project net RB9]
SDA2: MB4.11(SDA) MB5.11(SDA) MB6.11(SDA) P9.4 ; port SDA2  [project net RB3]
U1CTS: P12.1 P13.1 P14.1 W6.2(C2) W13.2(C2) W20.2(C2) ; port U1CTS  [project net RA8]
U1RTS: W5.1(C1) W8.2(C2) W12.1(C1) W15.2(C2) W19.1(C1) W22.2(C2) ; port U1RTS  [project net RC4]
U1RX: W10.2(C2) W17.2(C2) W24.2(C2) ; port U1RX  [project net RC3]
U1TX: W9.2(C2) W16.2(C2) W23.2(C2) ; port U1TX  [project net RB4]
NetK4_8: K4.8(ADR) R29.2
NetK4_9: K4.9(PS0) R28.2
NetK4_10: K4.10(PS1) R27.2
NetMB4_1: MB4.1(AN) W5.2(C2)
NetMB4_2: MB4.2(RST) W7.2(C2)
NetMB4_3: MB4.3(CS) P12.2
NetMB4_10: MB4.10(5V) W11.1(C1)
NetMB4_13: MB4.13(TX) W10.1(C1)
NetMB4_14: MB4.14(RX) W9.1(C1)
NetMB4_15: MB4.15(INT) W8.1(C1)
NetMB4_16: MB4.16(PWM) W6.1(C1)
NetMB5_1: MB5.1(AN) W12.2(C2)
NetMB5_2: MB5.2(RST) W14.2(C2)
NetMB5_3: MB5.3(CS) P13.2
NetMB5_10: MB5.10(5V) W18.1(C1)
NetMB5_13: MB5.13(TX) W17.1(C1)
NetMB5_14: MB5.14(RX) W16.1(C1)
NetMB5_15: MB5.15(INT) W15.1(C1)
NetMB5_16: MB5.16(PWM) W13.1(C1)
NetMB6_1: MB6.1(AN) W19.2(C2)
NetMB6_2: MB6.2(RST) W21.2(C2)
NetMB6_3: MB6.3(CS) P14.2
NetMB6_10: MB6.10(5V) W25.1(C1)
NetMB6_13: MB6.13(TX) W24.1(C1)
NetMB6_14: MB6.14(RX) W23.1(C1)
NetMB6_15: MB6.15(INT) W22.1(C1)
NetMB6_16: MB6.16(PWM) W20.1(C1)
NetP9_1: P9.1 W4.2(C2)
NetP9_2: P9.2 P16.2
NetP10_1: P10.1 R30.1 U5.2(IN_A-)
NetP10_3: P10.3 R25.2
NetP11_1: P11.1 R30.2 U5.1(OUT_A)
NetP11_3: P11.3 U5.6(IN_B-) U5.7(OUT_B)
NetR25_1: R25.1 R26.2 U5.5(IN_B+)
NetR31_1: R31.1 R32.2 U5.3(IN_A+)

Not connected (* = marked no-connect by the designer): J4 1(DAT2)* 8(DAT1)* 9(Card_Detect)* 10(Card_Detect)*; K4 1(Vin)

### Notes on the sheet
- CONS: 100mA max
- CONS: 4mA max
- La pin 1 est utilisée dans le cas d'un capteur à sortie analogique (Courant ou tension) :
  4mA-20mA ou 10%-90% Vs
- (near C18) Découplage
- MODE TENSION
- (near P10) 0.33V - 2.97V
- (near P10) 4mA - 20mA
- Entrées possibles
- I2C2(1)
- CONS: 12.3mA
- I2C2(2)
- (near U5) Correspondance des tensions :
  0.195V = 10% Vs
  1.756V = 90% Vs
- MODE COURANT
- UART
- Sortie analogique
- (near P11) MODE TENSION
- SPI
- capteur pression
- (near P11) MODE COURANT
- CONS: ?mA
- 2.021V
- (near U5) Correspondance des tensions :
  1.622V = 4mA
  0.021V = 20mA
- Fichier :
- a
- Date :
- Heure :
- Version :
- Auteur :
- Modif.
- b
- c
- d
- Projet :
- No :
- Nb feuilles
- Feuille n°
- Chemin :
- (in symbol mikroBUS compatible add-on board) +3.3V; +5V

### Library data of the parts
C16-C18 = C: as C1 on sheet SchemaBloc
J4 = uSD-WE-693071010811: WR-CRD Micro SD Card Connector Push & Push; Manufacturer: Wurth Elektronik; Contact Resistance: 100mOhm; Gender: Socket; Rated Current: 0.5A; Working Voltage: 100VAC; Withstanding Voltage: 500VAC; Manufacturer Part Number: 693071010811; Category: Input/Output Connectors; Match Code: WR-CRD; ComponentLink1Description: Website Link; ComponentLink1URL: https://www.we-online.com/redexpert/article/693071010811?ad; ComponentLink2Description: Datasheet Link; ComponentLink2URL: https://www.we-online.com/redexpert/spec/693071010811?ad; Mount: Surface Mount; Operating Temperature Max: 85°C; Operating Temperature Min: -25°C; Packaging: Tape and Reel; Number of Pins: 8; Type: Push & Push
MB4-MB6 = mikroBUS compatible add-on board
P9 = Header 5: Header, 5-Pin; LatestRevisionDate: 17-Jul-2002; LatestRevisionNote: Re-released for DXP Platform.; Publisher: Altium Limited; Supplier 1: Digi-Key
P10-P14 P16 = Header 3: Header, 3-Pin; LatestRevisionDate: 17-Jul-2002; LatestRevisionNote: Re-released for DXP Platform.; Publisher: Altium Limited
R25-R32 = Res2: Res 0805; Published: 8-Jun-2000; LatestRevisionDate: 17-Jul-2002; LatestRevisionNote: Re-released for DXP Platform.; PackageReference: AXIAL-0.4; Publisher: Altium Limited; PackageDescription: Axial Device, Thru-Hole; 2 Leads; 0.4 in Pin Spacing
  R25: Value: 47k
  R26 R32: Value: 68k
  R27-R29: Value: 10k
  R30: Value: 100R
  R31: Value: 43k
U5 = CMP-0272-00236-3: MicroPower, Rail-to-Rail Output, Dual, General Purpose Operational Amplifier, 2.7 to 36 V, -40 to 125 degC, 8-pin SOIC (D8), Green (RoHS & no Sb/Br); Manufacturer: Texas Instruments; Sub Family: High Supply Voltage Amplifier (>=30V), Low Power Amp (<=500uA), Low Supply Voltage Amplifier (<=2.7V), Precision Amplifier; CMRR(Min)(dB): 104; Slew Rate(Typ)(V/us): 0.4; GBW(Typ)(MHz): 1.2; Rating: Catalog; Offset Drift(Typ)(uV/C): 0.3; Packing: LARGE T&R; Number of Channels: 2; Total Supply Voltage(Min)(+5V is 5, +/-5V is 10): 2.7; Iq per channel(Max)(mA): 0.145; Total Supply Voltage(Max)(+5V is 5, +/-5V is 10): 36; Vio (25C)(Max)(mV): 1.8; IIB(Max)(pA): 15; ComponentLink3URL: http://www.ti.com/litv/pdf/msoi002j; Mounting Technology: Surface Mount; DatasheetVersion: SBOS557B; PartNumber: OPA2170AIDR; ComponentLink1Description: Manufacturer URL; ComponentLink1URL: http://www.ti.com/; Eco-Plan: Green (RoHS & no Sb/Br); ComponentLink2Description: Datasheet; PackageDescription: 8-Pin Plastic Small Outline, Body 4.9 x 3.9 mm, Pitch 1.27 mm; ComponentLink3Description: Package Specification; Code_JEDEC: MS-012; PackageVersion: 4040047-3/M, 06/2011; ComponentLink2URL: http://www.ti.com/lit/ds/symlink/opa2170.pdf; PackageReference: D0008A
W4-W25 = Jumper: Jumper Wire; Published: 24-Mar-1999; LatestRevisionDate: 17-Jul-2002; LatestRevisionNote: Re-released for DXP Platform.; PackageReference: RAD-0.2; Publisher: Altium Limited; PackageDescription: Radial Cap, Thru-Hole; 2 Leads; 0.2 in Pin Spacing

## Nets that join several sheets
+3V3: SchemaBloc (R1.2 R2.2 R3.2 R4.2), MCU (14 pins), Interface (R11.2 R12.2 R13.2), Power (11 pins), Peripherals (11 pins)
+5V: Power (R50.1), Peripherals (P16.3 W11.2 W18.2 W25.2)
GND: SchemaBloc (C1.2), MCU (22 pins), Interface (18 pins), Power (28 pins), Peripherals (18 pins)
VBUS: MCU (R23.2), Interface (L2.1 R9.2 U2.12), Power (9 pins)
AnPress: MCU (U3.22), Peripherals (P11.2)
BatLvl: MCU (U3.21), Power (R41.1 R42.2)
BatRead: MCU (U3.41), Power (R43.1)
BatStat: MCU (U3.20), Power (R33.1 U6.8)
ButtonMF: MCU (U3.25), Power (Q9.1 R46.1 R47.2)
CS_SD: MCU (P6.4 U4.11), Peripherals (J4.2)
CSM1: MCU (P6.3 U4.14), Peripherals (P12.3)
CSM2: MCU (P6.2 U4.13), Peripherals (P13.3)
CSM3: MCU (P6.1 U4.12), Peripherals (P14.3)
EN_5V: MCU (U3.38), Power (R49.1 U8.1)
INT_IMU: MCU (P7.1 U3.43), Peripherals (K4.7)
LED_B: MCU (U3.5), Interface (R14.2)
LED_G: MCU (U3.10), Interface (R16.2)
LED_R: MCU (U3.3), Interface (R18.2)
MISO: MCU (P6.5 U3.35), Peripherals (J4.7 MB4.5 MB5.5 MB6.5)
MOSI: MCU (P6.6 U3.34), Peripherals (J4.3 MB4.6 MB5.6 MB6.6)
PwrHold: MCU (U3.26), Power (Q8.1 R48.2)
RA8: MCU (P4.3 U3.32), Peripherals (6 pins)
RB2: SchemaBloc (R2.1), MCU (P8.1 U3.23), Peripherals (MB4.12 MB5.12 MB6.12 P9.5)
RB3: SchemaBloc (R1.1), MCU (P8.2 U3.24), Peripherals (MB4.11 MB5.11 MB6.11 P9.4)
RB4: MCU (P4.4 U3.33), Peripherals (W9.2 W16.2 W23.2)
RB6: MCU (P7.2 U3.42), Peripherals (K4.6)
RB8: SchemaBloc (R3.1), MCU (P7.4 U3.44), Peripherals (K4.4)
RB9: SchemaBloc (R4.1), MCU (P7.3 U3.1), Peripherals (K4.5)
RB13: MCU (P5.3 U3.11), Interface (U2.2)
RB14: SchemaBloc (C1.1), MCU (P6.7 U3.14), Peripherals (J4.5 MB4.4 MB5.4 MB6.4)
RB15: MCU (P5.2 U3.15), Interface (U2.6)
RC2: MCU (P5.4 U3.27), Interface (U2.4)
RC3: MCU (P4.1 U3.36), Peripherals (W10.2 W17.2 W24.2)
RC4: MCU (P4.2 U3.37), Peripherals (6 pins)
RC8: MCU (P5.1 U3.4), Interface (U2.1)
RSTM1: MCU (U4.10), Peripherals (W7.1)
RSTM2: MCU (U4.9), Peripherals (W14.1)
RSTM3: MCU (U4.7), Peripherals (W21.1)